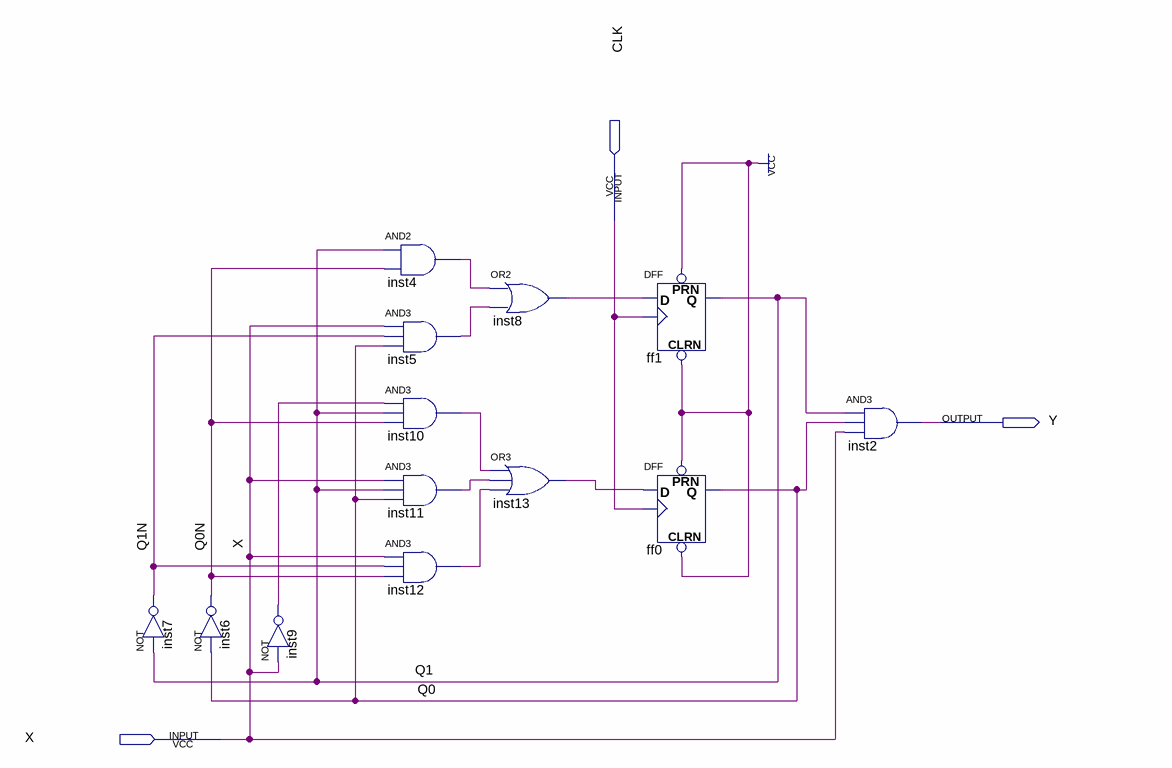
[diagram p0: schematic sheet]
// Quartus schematic SeqDet1101.bdf as structural Verilog: 13 symbols, 3 pins
module SeqDet1101 (
  input  CLK,
  input  X,
  output Y
);

  wire inst4_out, inst5_out, inst8_out, inst9_out, inst10_out, inst11_out, inst12_out, inst13_out, Q0, Q0N,
       Q1, Q1N;

  not inst7 (Q1N, Q1);
  not inst6 (Q0N, Q0);
  not inst9 (inst9_out, X);
  and inst4 (inst4_out, Q1, Q0N);
  and inst5 (inst5_out, X, Q1N, Q0);
  and inst10 (inst10_out, inst9_out, Q1, Q0N);
  and inst11 (inst11_out, X, Q1, Q0);
  and inst12 (inst12_out, X, Q1N, Q0N);
  or inst8 (inst8_out, inst4_out, inst5_out);
  or inst13 (inst13_out, inst10_out, inst11_out, inst12_out);
  DFF ff1 (.CLRN(1'b1), .CLK(CLK), .D(inst8_out), .PRN(1'b1), .Q(Q1));
  DFF ff0 (.CLRN(1'b1), .CLK(CLK), .D(inst13_out), .PRN(1'b1), .Q(Q0));
  and inst2 (Y, Q1, Q0, X);
endmodule
